# EAGLE design MicroWordClock2 (EAGLE 7.1.0)
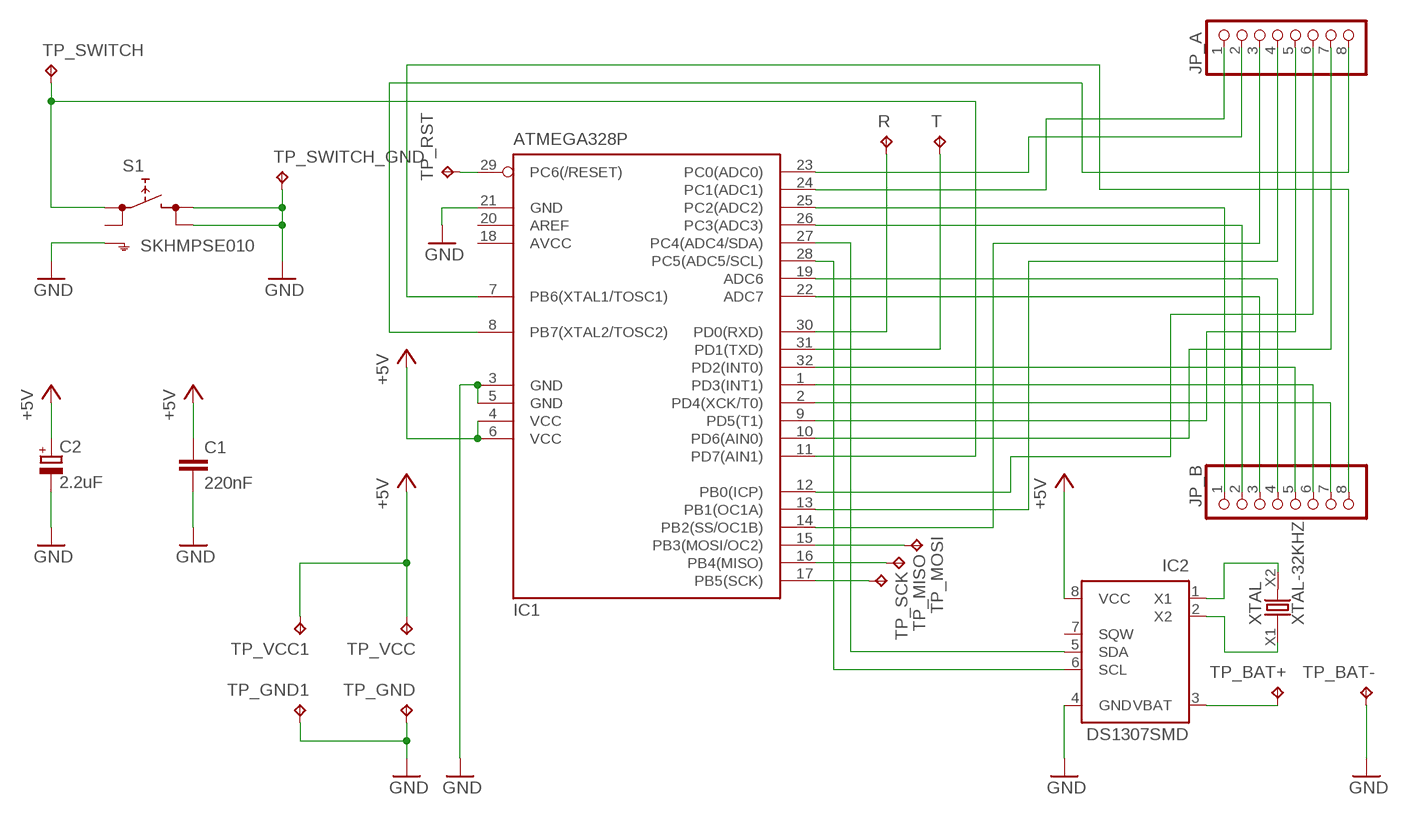
[diagram p0: schematic, sheet 1]

## Parts
C1  220nF  C-EUC0805  [C0805]
C2  2.2uF  CPOL-EUB/3528-21R  [B/3528-21R]
IC1  ATMEGA328P  MEGA8-AI  [TQFP32-08]
IC2  DS1307SMD  [SO-08M]
JP_A  PINHD-1X8CLEANBIG  [1X08-CLEANBIG]
JP_B  PINHD-1X8CLEANBIG  [1X08-CLEANBIG]
R  TPB1,27  [B1,27]
S1  SKHMPSE010  [SKHMPXE010]
T  TPB1,27  [B1,27]
TP_BAT+  TPB2,54  [B2,54]
TP_BAT-  TPB2,54  [B2,54]
TP_GND  TPB1,27  [B1,27]
TP_GND1  TPB2,54  [B2,54]
TP_MISO  TPB1,27  [B1,27]
TP_MOSI  TPB1,27  [B1,27]
TP_RST  TPB1,27  [B1,27]
TP_SCK  TPB1,27  [B1,27]
TP_SWITCH  TPB1,27  [B1,27]
TP_SWITCH_GND  TPB1,27  [B1,27]
TP_VCC  TPB1,27  [B1,27]
TP_VCC1  TPB2,54  [B2,54]
XTAL  XTAL-32KHZ  [XTAL-SMD-1206-3216M]

## Nets
+5V: C1.1 C2.+ IC1.4(VCC) IC1.6(VCC) IC2.8(VCC) TP_VCC1.TP TP_VCC.TP
A1: IC1.24(PC1(ADC1)) JP_A.1
A2: IC1.23(PC0(ADC0)) JP_A.2
A3: IC1.14(PB2(SS/OC1B)) JP_A.3
A4: IC1.13(PB1(OC1A)) JP_A.4
A5: IC1.9(PD5(T1)) JP_A.5
A6: IC1.12(PB0(ICP)) JP_A.6
A7: IC1.10(PD6(AIN0)) JP_A.7
A8: IC1.8(PB7(XTAL2/TOSC2)) JP_A.8
B1: IC1.25(PC2(ADC2)) JP_B.1
B2: IC1.26(PC3(ADC3)) JP_B.2
B3: IC1.22(ADC7) JP_B.3
B4: IC1.19(ADC6) JP_B.4
B5: IC1.32(PD2(INT0)) JP_B.5
B6: IC1.1(PD3(INT1)) JP_B.6
B7: IC1.2(PD4(XCK/T0)) JP_B.7
B8: IC1.7(PB6(XTAL1/TOSC1)) JP_B.8
GND: C1.2 C2.- IC1.3(GND) IC1.5(GND) IC1.21(GND) IC2.4(GND) S1.3(2.1) S1.4(2.2) S1.5(SH) TP_BAT-.TP TP_GND1.TP TP_GND.TP TP_SWITCH_GND.TP
MISO: IC1.16(PB4(MISO)) TP_MISO.TP
MOSI: IC1.15(PB3(MOSI/OC2)) TP_MOSI.TP
N$1: IC1.31(PD1(TXD)) T.TP
N$2: IC2.2(X2) XTAL.X1
N$3: IC1.30(PD0(RXD)) R.TP
N$14: IC2.1(X1) XTAL.X2
N$18: IC1.28(PC5(ADC5/SCL)) IC2.6(SCL)
RESET: IC1.29(PC6(/RESET)) TP_RST.TP
SCK: IC1.17(PB5(SCK)) TP_SCK.TP
SDA: IC1.27(PC4(ADC4/SDA)) IC2.5(SDA)
SWITCH: IC1.11(PD7(AIN1)) S1.1(1.1) TP_SWITCH.TP
VBAT: IC2.3(VBAT) TP_BAT+.TP
Unconnected: IC1.20(AREF) IC2.7(SQW) S1.2(1.2)

## Power pins joined to a net without a drawn wire
AVCC: IC1.18(AVCC)

## Library data of the parts
C1 = rcl:C-EU: CAPACITOR, European symbol
C2 = rcl:CPOL-EU: POLARIZED CAPACITOR, European symbol
IC1 = atmel:MEGA8: MICROCONTROLLER 8 Kbytes FLASH, 1 kbytes SRAM, 512 bytes EEPROM, USART, 6-channel 10 bit ADC, 2-channel 8 bit ADC Pin compatible with Atmega48, ATMega88, ATMega168 Source: avr.lbr; MPN: ATMEGA8-16AU; OC_FARNELL: 9171371; OC_NEWARK: 73M8863
IC2 = DS1307:DS1307: DS1307 - 64×8, Serial, I2C Real Time Clock
JP_A JP_B = adafruit:PINHD-1X8: PIN HEADER
R T TP_BAT+ TP_BAT- TP_GND TP_GND1 TP_MISO TP_MOSI TP_RST TP_SCK TP_SWITCH TP_SWITCH_GND TP_VCC TP_VCC1 = testpad:TP: Test pad
S1 = switch:SKHMP*E010: 6.2 X 6.5mm TACT Switch (SMD) Source: http://www3.alps.co.jp/WebObjects/catalog.woa/PDF/E/Switch/Tact/SKHM/SKHM.PDF
XTAL = xtal-32khz:XTAL-32KHZ

## Board
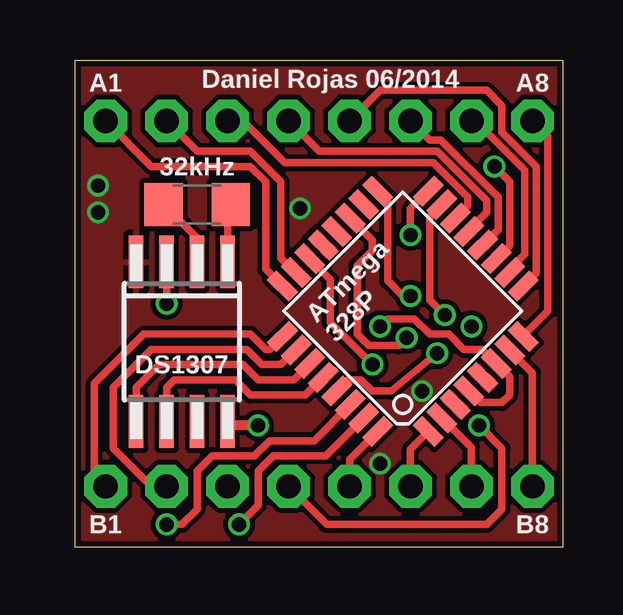
[diagram p1: board, top side]
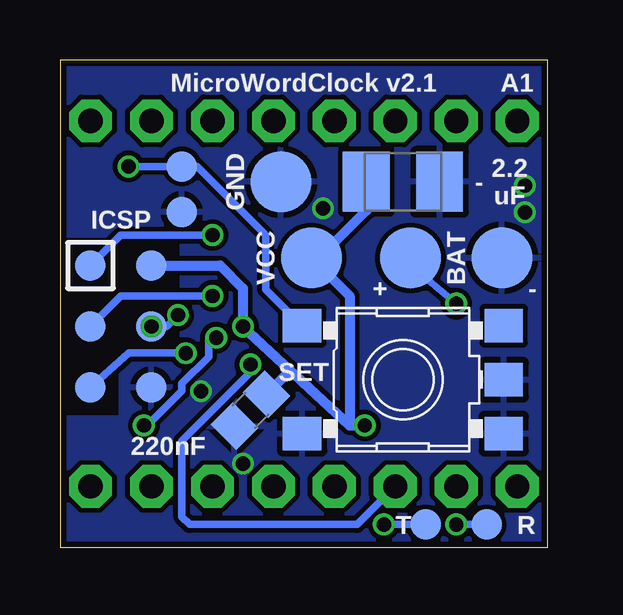
[diagram p2: board, bottom side, seen from below]

Size 20.32 x 20.32 mm. Coordinates in mm from the lower left corner, seen from the top.
Outline: 0,0 0,20.32 20.32,20.32 20.32,0 0,0
Copper layers (1*16): Top 0.035mm / dielectric 1.5mm / Bottom 0.035mm
Design rules "dirt_cheap_dirty_boards.v1": minimum track width 5mil, minimum drill 12mil, track to track 5mil, track to pad 5mil, pad to pad 5mil, via to via 5mil, smd to smd 0mil, copper to edge 10mil, drill to drill 10mil, minimum pad ring 10mil, minimum via ring 6mil, stop-mask expansion 2mil, vias tented up to drill 25mil, thermal gap 10mil

### Footprints (pad centres in the part's own frame; a part is rotated, then mirrored left to right if it is on the bottom)
C0805 = smd 1.3 x 1.5: 1 -0.95,0; 2 0.95,0
B/3528-21R = smd 1.95 x 2.5: + 1.525,0; - -1.525,0
TQFP32-08 = smd 1.27 x 0.559: 1 -4.293,2.8; 2 -4.293,2; 3 -4.293,1.2; 4 -4.293,0.4; 5 -4.293,-0.4; 6 -4.293,-1.2; 7 -4.293,-2; 8 -4.293,-2.8; 17 4.293,-2.8; 18 4.293,-2; 19 4.293,-1.2; 20 4.293,-0.4; 21 4.293,0.4; 22 4.293,1.2; 23 4.293,2; 24 4.293,2.8 | smd 0.559 x 1.27: 9 -2.8,-4.293; 10 -2,-4.293; 11 -1.2,-4.293; 12 -0.4,-4.293; 13 0.4,-4.293; 14 1.2,-4.293; 15 2,-4.293; 16 2.8,-4.293; 25 2.8,4.293; 26 2,4.293; 27 1.2,4.293; 28 0.4,4.293; 29 -0.4,4.293; 30 -1.2,4.293; 31 -2,4.293; 32 -2.8,4.293
SO-08M = smd 0.6 x 2.2: 1 -1.905,-3.33; 2 -0.635,-3.33; 3 0.635,-3.33; 4 1.905,-3.33; 5 1.905,3.33; 6 0.635,3.33; 7 -0.635,3.33; 8 -1.905,3.33
1X08-CLEANBIG = drill 1.016 pad 1.778 octagon: 1 -8.89,0; 2 -6.35,0; 3 -3.81,0; 4 -1.27,0; 5 1.27,0; 6 3.81,0; 7 6.35,0; 8 8.89,0
B1,27 = smd 1.27 x 1.27: TP 0,0
SKHMPXE010 = smd 1.6 x 1.4: 1 -4.2,2.25; 2 4.2,2.25; 3 -4.2,-2.25; 4 4.2,-2.25; 5 4.2,0
B2,54 = smd 2.54 x 2.54: TP 0,0
XTAL-SMD-1206-3216M = smd 1.6 x 1.8: X1 -1.4,0; X2 1.4,0

### Placement (x,y rotation side)
C1  12.38,5.71 225 bottom
C2  6.03,15.24 180 bottom
IC1  13.65,9.84 135 top
IC2  4.45,8.57 180 top
JP_A  10.16,17.78 0 top
JP_B  10.16,2.54 0 top
R  2.54,0.95 0 bottom
S1  6.03,6.99 0 bottom
T  5.08,0.95 0 bottom
TP_BAT+  5.71,12.06 0 bottom
TP_BAT-  1.91,12.06 0 bottom
TP_GND  16.51,6.67 0 bottom
TP_GND1  11.11,15.24 0 bottom
TP_MISO  19.05,11.75 0 bottom
TP_MOSI  16.51,9.21 0 bottom
TP_RST  19.05,6.67 0 bottom
TP_SCK  19.05,9.21 0 bottom
TP_SWITCH  15.24,15.88 0 bottom
TP_SWITCH_GND  15.24,13.97 0 bottom
TP_VCC  16.51,11.75 0 bottom
TP_VCC1  9.84,12.06 0 bottom
XTAL  5.08,14.29 0 top

### Tracks (layer width: path | path; a pad name or v marks a point on that pad's centre or on a via)
+5V  (via drill 0.6)
  Top 0.305: v12.7,9.21 13.02,9.53 14.13,9.53 14.76,8.89 15.56,8.89 16.19,8.26 16.94,8.26 IC1.6 18.1,7.09 18.1,6.35 17.78,6.03 16.9,6.03 IC1.4
  Top 0.406: v7.62,5.08 6.51,5.08 arc-90 IC2.8
  Bottom 0.406: TP_VCC.TP 13.65,11.75 12.7,10.79 v12.7,9.21 10.73,7.38 | 8.26,5.08 9.91,6.62 10.54,7.21 10.73,7.38 | TP_VCC1.TP 8.26,10.48 8.26,5.08 | 8.26,5.08 v7.62,5.08 | TP_VCC1.TP 10.5,12.72 8.87,12.72 7.56,14.03 C2.+ 7.99,15.24 | C1.1 10.73,7.37 10.73,7.38 | TP_VCC1.TP 9.78,12.06
A1
  Top 0.305: JP_A.1 3.17,15.88 7.3,15.88 7.94,15.24 7.94,11.6 IC1.24
A2
  Top 0.203: IC1.23 9.17,11.46
  Top 0.305: 9.17,11.46 8.57,12.06 8.57,15.24 7.3,16.51 5.08,16.51 JP_A.2
A3
  Top 0.305: JP_A.3 6.99,17.78 8.73,16.03 14.92,16.03 16.35,14.61 16.35,14.24 IC1.14
A4
  Top 0.305: JP_A.4 10.16,16.51 15.08,16.51 17.14,14.45 17.14,13.97 16.41,13.23 IC1.13
A5
  Top 0.305: JP_A.5 12.7,19.05 17.14,19.05 17.78,18.41 17.78,17.3 19.21,15.88 19.21,11.44 IC1.9
A6
  Top 0.305: JP_A.6 14.76,16.99 15.24,16.99 17.62,14.61 17.62,13.25 IC1.12
A7
  Top 0.203: IC1.10 18.13,11.46 18.41,11.75 | JP_A.7 16.67,17.78
  Top 0.305: 18.41,11.75 18.41,11.91 18.73,12.22 18.73,15.72 16.67,17.78
A8
  Top 0.203: IC1.8 18.67,8.82
  Top 0.305: 18.67,8.82 19.68,9.84 19.68,17.14 JP_A.8
B1
  Top 0.305: IC1.25 8.11,8.26 7.94,8.26 7.3,8.89 2.86,8.89 0.79,6.83 0.79,3.02 JP_B.1
B2
  Top 0.203: IC1.26 9.17,8.22
  Top 0.305: 9.17,8.22 8.57,7.62 7.78,7.62 7.14,8.26 3.17,8.26 1.59,6.67 1.59,4.13 3.17,2.54 JP_B.2
B3  (via drill 0.6)
  Top 0.305: v12.38,7.62 10.64,9.37 10.64,11.16 IC1.22
  Bottom 0.305: JP_B.3 7.94,0.95 14.92,0.95 15.24,1.27 15.24,4.45 12.38,7.3 v12.38,7.62
B4  (via drill 0.6)
  Top 0.305: JP_B.4 10.48,0.95 17.14,0.95 17.78,1.59 17.78,4.13 v16.83,5.08 | v13.81,8.73 13.49,8.41 12.22,8.41 11.75,8.89 11.75,11.75 12.38,12.38 12.38,12.81 IC1.19
  Bottom 0.305: v16.83,5.08 16.67,5.24 16.51,5.24 15.24,6.51 15.24,6.83 14.13,7.94 14.13,8.57 13.97,8.73 v13.81,8.73
B5
  Top 0.305: JP_B.5 11.43,3.66 IC1.32
B6
  Top 0.305: JP_B.6 13.97,4.09 IC1.1
B7
  Top 0.305: JP_B.7 16.51,4.16 IC1.2
B8
  Top 0.305: JP_B.8 19.05,7.27 IC1.7
GND  (via drill 0.6)
  other vias: 14.45,6.51 0.95,13.97 9.37,14.13 12.7,3.49 0.95,15.08
  pour Top (isolate 0.203): 0,0 0,20.32 20.32,20.32 20.32,0
  pour Bottom (isolate 0.203): 0,20.32 20.32,20.32 20.32,13.02 15.24,13.02 15.24,7.94 17.78,7.94 17.78,5.4 20.32,5.4 20.32,0 0,0
MISO  (via drill 0.6)
  Top 0.305: v13.97,13.02 13.97,14.12 IC1.16
  Bottom 0.305: TP_MISO.TP 17.78,13.02 v13.97,13.02
MOSI  (via drill 0.6)
  Top 0.305: v15.4,9.68 14.76,10.32 14.76,13.78 IC1.15
  Bottom 0.305: TP_MOSI.TP 15.88,9.21 v15.4,9.68
  other vias: 16.51,9.21
N$1  (via drill 0.6)
  Top 0.305: IC1.31 10.45,3.81 8.26,3.81 7.62,3.17 7.62,1.75 v6.83,0.95
  Bottom 0.305: v6.83,0.95 T.TP
N$2
  Top 0.203: 5.08,12.89 IC2.2
  Top 0.305: XTAL.X1 5.08,12.89
N$3  (via drill 0.6)
  Top 0.305: IC1.30 9.95,4.45 8.1,4.45 7.46,3.81 5.71,3.81 5.08,3.17 5.08,1.59 4.45,0.95 v3.81,0.95
  Bottom 0.305: v3.81,0.95 R.TP
N$14
  Top 0.203: XTAL.X2 6.35,14.16
  Top 0.305: 6.35,14.16 IC2.1
N$18
  Top 0.305: IC1.28 9.59,6.35 7.3,6.35 6.67,6.99 4.13,6.99 3.81,6.67 IC2.6
RESET  (via drill 0.6)
  Top 0.305: v15.08,8.1 13.18,6.51 12.38,6.51 11.91,6.99 11.36,6.99 IC1.29
  Bottom 0.305: TP_RST.TP 17.46,8.1 v15.08,8.1
SCK  (via drill 0.6)
  Top 0.305: v13.97,10.48 13.65,10.48 13.02,11.11 13.02,14.44 IC1.17
  Bottom 0.305: TP_SCK.TP 17.78,10.48 v13.97,10.48
SDA
  Top 0.305: IC1.27 9.1,6.99 7.62,6.99 6.99,7.62 3.49,7.62 2.54,6.67 IC2.5
SWITCH  (via drill 0.6)
  Top 0.305: v17.46,15.88 18.1,15.24 18.1,12.59 IC1.11
  Bottom 0.305: S1.1 11.75,10.75 11.75,13.02 14.61,15.88 TP_SWITCH.TP v17.46,15.88
VBAT  (via drill 0.6)
  Top 0.305: v3.81,10.16 IC2.3
  Bottom 0.203: TP_BAT+.TP 5.71,11.75
  Bottom 0.305: 5.71,11.75 v3.81,10.16

### Text on the board
tPlace: Daniel Rojas 06/2014 | A1 | A8 | 32kHz | ATmega / 328P | DS1307 | B1 | B8
bPlace: A1 | MicroWordClock v2.1 | 2.2 / uF | - | GND | ICSP | BAT | VCC | - | + | SET